# Altium schematic sheet CPU.SchDoc
size A4
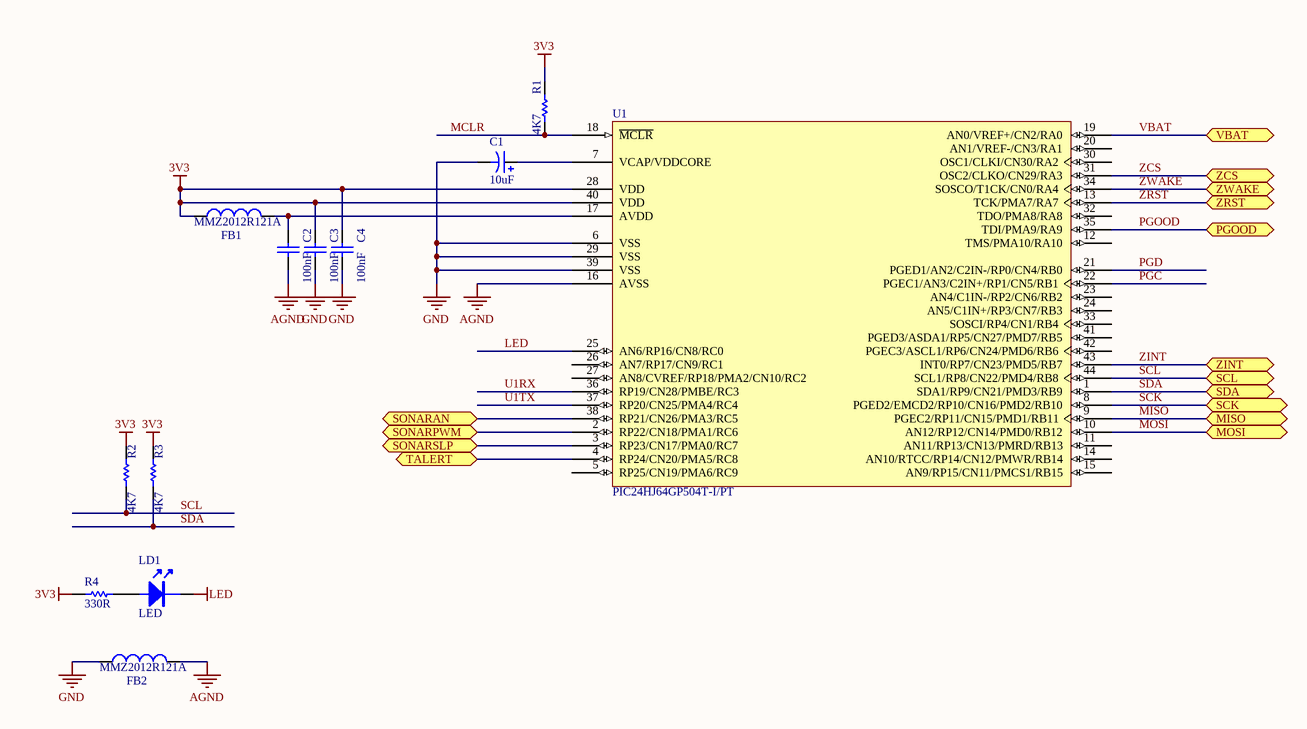
[diagram p0: CPU.SchDoc]

## Parts
C1  value 10uF  [B]  (hidden comment: Cap Pol3)
C2  value 100nF  [RESC2012L]  (hidden comment: CAP0603-)
C3  value 100nF  [RESC2012L]  (hidden comment: CAP0603-)
C4  value 100nF  [RESC2012L]  (hidden comment: CAP0603-)
FB1  MMZ2012R121A  [RESC2012L]
FB2  MMZ2012R121A  [RESC2012L]
LD1  LED  [LED805]
R1  value 4K7  [RESC2012L]  (hidden comment: RES0603-)
R2  value 4K7  [RESC2012L]  (hidden comment: RES0603-)
R3  value 4K7  [RESC2012L]  (hidden comment: RES0603-)
R4  value 330R  [RESC2012L]  (hidden comment: RES0603-)
U1  PIC24HJ64GP504T-I/PT  [TQFP-PT44_M]

## Ports
MISO, MOSI, PGOOD, SCK, SCL, SDA, SONARAN, SONARPWM, SONARSLP, TALERT, VBAT, ZCS, ZINT, ZRST, ZWAKE

## Nets
3V3: C3.2 C4.2 FB1.1 R1.2 R2.2 R3.2 R4.2 U1.28(VDD) U1.40(VDD)
AGND: C2.1 FB2.2 U1.16(AVSS)
GND: C1.2 C3.1 C4.1 FB2.1 U1.6(VSS) U1.29(VSS) U1.39(VSS)
LED: LD1.K U1.25(AN6/RP16/CN8/RC0)
MCLR: R1.1 U1.18(~{MCLR})
MISO: U1.9(PGEC2/RP11/CN15/PMD1/RB11) ; port MISO
MOSI: U1.10(AN12/RP12/CN14/PMD0/RB12) ; port MOSI
PGC: U1.22(PGEC1/AN3/C2IN+/RP1/CN5/RB1)
PGD: U1.21(PGED1/AN2/C2IN-/RP0/CN4/RB0)
PGOOD: U1.35(TDI/PMA9/RA9) ; port PGOOD
SCK: U1.8(PGED2/EMCD2/RP10/CN16/PMD2/RB10) ; port SCK
SCL: R2.1 U1.44(SCL1/RP8/CN22/PMD4/RB8) ; port SCL
SDA: R3.1 U1.1(SDA1/RP9/CN21/PMD3/RB9) ; port SDA
SONARAN: U1.38(RP21/CN26/PMA3/RC5) ; port SONARAN
SONARPWM: U1.2(RP22/CN18/PMA1/RC6) ; port SONARPWM
SONARSLP: U1.3(RP23/CN17/PMA0/RC7) ; port SONARSLP
TALERT: U1.4(RP24/CN20/PMA5/RC8) ; port TALERT
U1RX: U1.36(RP19/CN28/PMBE/RC3)
U1TX: U1.37(RP20/CN25/PMA4/RC4)
VBAT: U1.19(AN0/VREF+/CN2/RA0) ; port VBAT
ZCS: U1.31(OSC2/CLKO/CN29/RA3) ; port ZCS
ZINT: U1.43(INT0/RP7/CN23/PMD5/RB7) ; port ZINT
ZRST: U1.13(TCK/PMA7/RA7) ; port ZRST
ZWAKE: U1.34(SOSCO/T1CK/CN0/RA4) ; port ZWAKE
NetC1_1: C1.1 U1.7(VCAP/VDDCORE)
NetC2_2: C2.2 FB1.2 U1.17(AVDD)
NetLD1_A: LD1.A R4.1

Not connected (* = marked no-connect by the designer): U1 5(RP25/CN19/PMA6/RC9) 11(AN11/RP13/CN13/PMRD/RB13) 12(TMS/PMA10/RA10) 14(AN10/RTCC/RP14/CN12/PMWR/RB14) 15(AN9/RP15/CN11/PMCS1/RB15) 20(AN1/VREF-/CN3/RA1) 23(AN4/C1IN-/RP2/CN6/RB2) 24(AN5/C1IN+/RP3/CN7/RB3) 26(AN7/RP17/CN9/RC1) 27(AN8/CVREF/RP18/PMA2/CN10/RC2) 30(OSC1/CLKI/CN30/RA2) 32(TDO/PMA8/RA8) 33(SOSCI/RP4/CN1/RB4) 41(PGED3/ASDA1/RP5/CN27/PMD7/RB5) 42(PGEC3/ASCL1/RP6/CN24/PMD6/RB6)

## Library data of the parts
C1 = Cap Pol3: Polarized Capacitor (Surface Mount); Published: 8-Jun-2000; LatestRevisionDate: 29-May-2009; LatestRevisionNote: IPC-7351 Footprint Added.; PackageReference: C0805; Publisher: Altium Limited; PackageDescription: Chip Capacitor
C2-C4 = Cap Semi: Capacitor (Semiconductor SIM Model); Published: 8-Jun-2000; LatestRevisionDate: 29-May-2009; LatestRevisionNote: IPC-7351 Footprint Added.; PackageReference: C1206; Publisher: Altium Limited; PackageDescription: Chip Capacitor
FB1 FB2 = Inductor: Code_IEC: 1005; Published: 8-Jun-2000; LatestRevisionDate: 29-May-2009; LatestRevisionNote: IPC-7351 Footprint Added.; PackageReference: 0402-A; Publisher: Altium Limited; PackageDescription: Chip Inductor; Code_JEITA: 0402
R1-R4 = Res Semi: Semiconductor Resistor; Published: 8-Jun-2000; LatestRevisionDate: 17-Jul-2002; LatestRevisionNote: Re-released for DXP Platform.; PackageReference: AXIAL-0.5; Publisher: Altium Limited
U1 = PIC24HJ64GP504T-I/PT: High Speed General Purpose 16-Bit Flash Microcontroller, 64KB Flash, 8KB RAM, 44-Pin TQFP, Industrial Temperature, Tape and Reel; FirstPublished: 2-Dec-2009; DatasheetVersion: revD, Nov-2009; PackageVersion: revBB, Aug-2009; PackageReference: TQFP-PT44; Publisher: Altium Limited; PackageDescription: 44-Lead Plastic Thin Quad Flatpack (PT) - 10x10x1mm Body, 2.00mm [TQFP]; Supplier 1: Digi-Key; Supplier Part Number 1: PIC24HJ64GP504T-I/PTTR-ND; Supplier 2: Newark; Supplier Part Number 2: 40M1549; Code_JEDEC: MS-026; ComponentLink1Description: Datasheet; ComponentLink1URL: http://ww1.microchip.com/downloads/en/DeviceDoc/70293D.pdf; ComponentLink2Description: Packaging Specification; ComponentLink2URL: http://www.microchip.com/stellent/groups/techpub_sg/documents/packagingspec/en012702.pdf; ComponentLink3Description: Microchip.com Home; ComponentLink3URL: http://www.microchip.com/